# Altium schematic sheet DDR3 Memory.SchDoc
size A4; DrawnBy: Chris Segiet
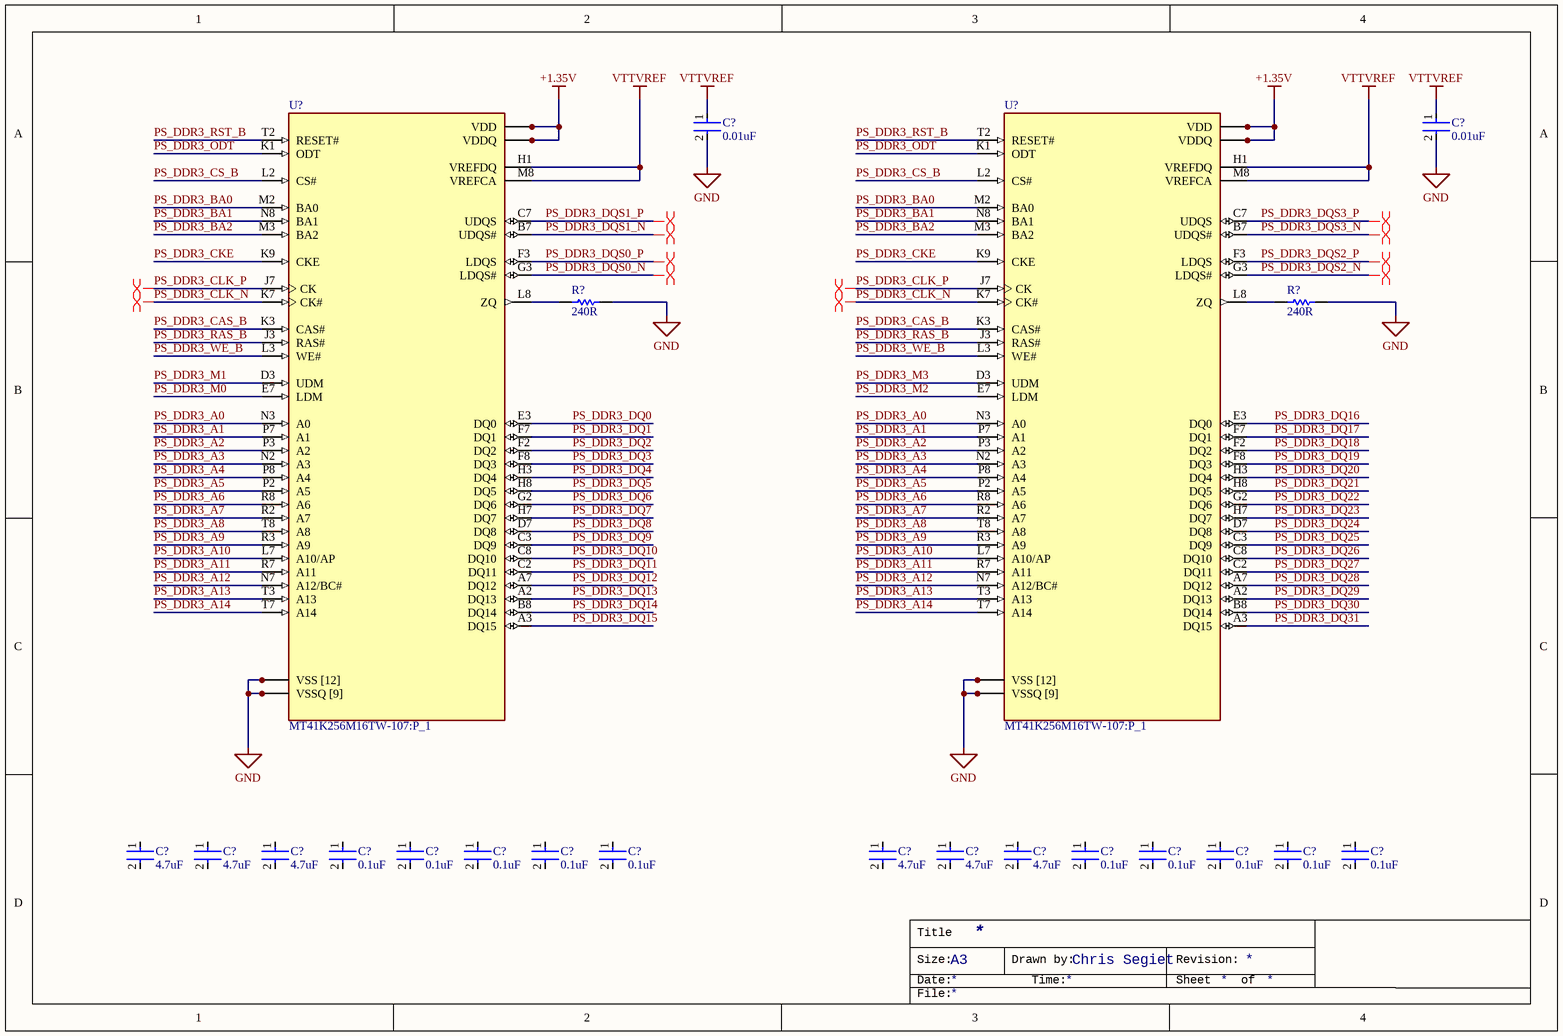
[diagram p0: DDR3 Memory.SchDoc]

## Parts
(Parts that share a designator on the sheet are numbered #1, #2 ... from top to bottom, then left to right.)
C?#1  0.01uF  [FP-C1005-050-0_05-IPC_B]
C?#2  0.01uF  [FP-C1005-050-0_05-IPC_B]
C?#3  4.7uF  [FP-C2012-125-0_2-MFG]
C?#4  4.7uF  [FP-C2012-125-0_2-MFG]
C?#5  4.7uF  [FP-C2012-125-0_2-MFG]
C?#6  0.1uF  [FP-CGA3E-0_3-0_1-IPC_C]
C?#7  0.1uF  [FP-CGA3E-0_3-0_1-IPC_C]
C?#8  0.1uF  [FP-CGA3E-0_3-0_1-IPC_C]
C?#9  0.1uF  [FP-CGA3E-0_3-0_1-IPC_C]
C?#10  0.1uF  [FP-CGA3E-0_3-0_1-IPC_C]
C?#11  4.7uF  [FP-C2012-125-0_2-MFG]
C?#12  4.7uF  [FP-C2012-125-0_2-MFG]
C?#13  4.7uF  [FP-C2012-125-0_2-MFG]
C?#14  0.1uF  [FP-CGA3E-0_3-0_1-IPC_C]
C?#15  0.1uF  [FP-CGA3E-0_3-0_1-IPC_C]
C?#16  0.1uF  [FP-CGA3E-0_3-0_1-IPC_C]
C?#17  0.1uF  [FP-CGA3E-0_3-0_1-IPC_C]
C?#18  0.1uF  [FP-CGA3E-0_3-0_1-IPC_C]
R?#1  240R  [RESC1005X40X25ML05T05]
R?#2  240R  [RESC1005X40X25ML05T05]
U?#1  MT41K256M16TW-107:P_1  [BGA96C80P9X16_1400X800X120]
U?#2  MT41K256M16TW-107:P_1  [BGA96C80P9X16_1400X800X120]

## Nets
+1.35V: U?#1.A1(VDDQ) U?#1.A8(VDDQ) U?#1.B2(VDD) U?#1.C1(VDDQ) U?#1.C9(VDDQ) U?#1.D2(VDDQ) U?#1.D9(VDD) U?#1.E9(VDDQ) U?#1.F1(VDDQ) U?#1.G7(VDD) U?#1.H2(VDDQ) U?#1.H9(VDDQ) U?#1.K2(VDD) U?#1.K8(VDD) U?#1.N1(VDD) U?#1.N9(VDD) U?#1.R1(VDD) U?#1.R9(VDD) U?#2.A1(VDDQ) U?#2.A8(VDDQ) U?#2.B2(VDD) U?#2.C1(VDDQ) U?#2.C9(VDDQ) U?#2.D2(VDDQ) U?#2.D9(VDD) U?#2.E9(VDDQ) U?#2.F1(VDDQ) U?#2.G7(VDD) U?#2.H2(VDDQ) U?#2.H9(VDDQ) U?#2.K2(VDD) U?#2.K8(VDD) U?#2.N1(VDD) U?#2.N9(VDD) U?#2.R1(VDD) U?#2.R9(VDD)
GND: C?#1.2 C?#2.2 R?#1.2 R?#2.2 U?#1.A9(VSS_[12]) U?#1.B1(VSSQ) U?#1.B3(VSS) U?#1.B9(VSSQ) U?#1.D1(VSSQ) U?#1.D8(VSSQ) U?#1.E1(VSS) U?#1.E2(VSSQ) U?#1.E8(VSSQ) U?#1.F9(VSSQ) U?#1.G1(VSSQ) U?#1.G8(VSS) U?#1.G9(VSSQ_[9]) U?#1.J2(VSS) U?#1.J8(VSS) U?#1.M1(VSS) U?#1.M9(VSS) U?#1.P1(VSS) U?#1.P9(VSS) U?#1.T1(VSS) U?#1.T9(VSS) U?#2.A9(VSS_[12]) U?#2.B1(VSSQ) U?#2.B3(VSS) U?#2.B9(VSSQ) U?#2.D1(VSSQ) U?#2.D8(VSSQ) U?#2.E1(VSS) U?#2.E2(VSSQ) U?#2.E8(VSSQ) U?#2.F9(VSSQ) U?#2.G1(VSSQ) U?#2.G8(VSS) U?#2.G9(VSSQ_[9]) U?#2.J2(VSS) U?#2.J8(VSS) U?#2.M1(VSS) U?#2.M9(VSS) U?#2.P1(VSS) U?#2.P9(VSS) U?#2.T1(VSS) U?#2.T9(VSS)
VTTVREF: C?#1.1 C?#2.1 U?#1.H1(VREFDQ) U?#1.M8(VREFCA) U?#2.H1(VREFDQ) U?#2.M8(VREFCA)
PS_DDR3_A0: U?#1.N3(A0) U?#2.N3(A0)
PS_DDR3_A1: U?#1.P7(A1) U?#2.P7(A1)
PS_DDR3_A2: U?#1.P3(A2) U?#2.P3(A2)
PS_DDR3_A3: U?#1.N2(A3) U?#2.N2(A3)
PS_DDR3_A4: U?#1.P8(A4) U?#2.P8(A4)
PS_DDR3_A5: U?#1.P2(A5) U?#2.P2(A5)
PS_DDR3_A6: U?#1.R8(A6) U?#2.R8(A6)
PS_DDR3_A7: U?#1.R2(A7) U?#2.R2(A7)
PS_DDR3_A8: U?#1.T8(A8) U?#2.T8(A8)
PS_DDR3_A9: U?#1.R3(A9) U?#2.R3(A9)
PS_DDR3_A10: U?#1.L7(A10/AP) U?#2.L7(A10/AP)
PS_DDR3_A11: U?#1.R7(A11) U?#2.R7(A11)
PS_DDR3_A12: U?#1.N7(A12/BC#) U?#2.N7(A12/BC#)
PS_DDR3_A13: U?#1.T3(A13) U?#2.T3(A13)
PS_DDR3_A14: U?#1.T7(A14) U?#2.T7(A14)
PS_DDR3_BA0: U?#1.M2(BA0) U?#2.M2(BA0)
PS_DDR3_BA1: U?#1.N8(BA1) U?#2.N8(BA1)
PS_DDR3_BA2: U?#1.M3(BA2) U?#2.M3(BA2)
PS_DDR3_CAS_B: U?#1.K3(CAS#) U?#2.K3(CAS#)
PS_DDR3_CKE: U?#1.K9(CKE) U?#2.K9(CKE)
PS_DDR3_CLK_N: U?#1.K7(CK#) U?#2.K7(CK#)
PS_DDR3_CLK_P: U?#1.J7(CK) U?#2.J7(CK)
PS_DDR3_CS_B: U?#1.L2(CS#) U?#2.L2(CS#)
PS_DDR3_DQ0: U?#1.E3(DQ0)
PS_DDR3_DQ1: U?#1.F7(DQ1)
PS_DDR3_DQ2: U?#1.F2(DQ2)
PS_DDR3_DQ3: U?#1.F8(DQ3)
PS_DDR3_DQ4: U?#1.H3(DQ4)
PS_DDR3_DQ5: U?#1.H8(DQ5)
PS_DDR3_DQ6: U?#1.G2(DQ6)
PS_DDR3_DQ7: U?#1.H7(DQ7)
PS_DDR3_DQ8: U?#1.D7(DQ8)
PS_DDR3_DQ9: U?#1.C3(DQ9)
PS_DDR3_DQ10: U?#1.C8(DQ10)
PS_DDR3_DQ11: U?#1.C2(DQ11)
PS_DDR3_DQ12: U?#1.A7(DQ12)
PS_DDR3_DQ13: U?#1.A2(DQ13)
PS_DDR3_DQ14: U?#1.B8(DQ14)
PS_DDR3_DQ15: U?#1.A3(DQ15)
PS_DDR3_DQ16: U?#2.E3(DQ0)
PS_DDR3_DQ17: U?#2.F7(DQ1)
PS_DDR3_DQ18: U?#2.F2(DQ2)
PS_DDR3_DQ19: U?#2.F8(DQ3)
PS_DDR3_DQ20: U?#2.H3(DQ4)
PS_DDR3_DQ21: U?#2.H8(DQ5)
PS_DDR3_DQ22: U?#2.G2(DQ6)
PS_DDR3_DQ23: U?#2.H7(DQ7)
PS_DDR3_DQ24: U?#2.D7(DQ8)
PS_DDR3_DQ25: U?#2.C3(DQ9)
PS_DDR3_DQ26: U?#2.C8(DQ10)
PS_DDR3_DQ27: U?#2.C2(DQ11)
PS_DDR3_DQ28: U?#2.A7(DQ12)
PS_DDR3_DQ29: U?#2.A2(DQ13)
PS_DDR3_DQ30: U?#2.B8(DQ14)
PS_DDR3_DQ31: U?#2.A3(DQ15)
PS_DDR3_DQS0_N: U?#1.G3(LDQS#)
PS_DDR3_DQS0_P: U?#1.F3(LDQS)
PS_DDR3_DQS1_N: U?#1.B7(UDQS#)
PS_DDR3_DQS1_P: U?#1.C7(UDQS)
PS_DDR3_DQS2_N: U?#2.G3(LDQS#)
PS_DDR3_DQS2_P: U?#2.F3(LDQS)
PS_DDR3_DQS3_N: U?#2.B7(UDQS#)
PS_DDR3_DQS3_P: U?#2.C7(UDQS)
PS_DDR3_M0: U?#1.E7(LDM)
PS_DDR3_M1: U?#1.D3(UDM)
PS_DDR3_M2: U?#2.E7(LDM)
PS_DDR3_M3: U?#2.D3(UDM)
PS_DDR3_ODT: U?#1.K1(ODT) U?#2.K1(ODT)
PS_DDR3_RAS_B: U?#1.J3(RAS#) U?#2.J3(RAS#)
PS_DDR3_RST_B: U?#1.T2(RESET#) U?#2.T2(RESET#)
PS_DDR3_WE_B: U?#1.L3(WE#) U?#2.L3(WE#)
NetR?#1_1: R?#1.1 U?#1.L8(ZQ)
NetR?#2_1: R?#2.1 U?#2.L8(ZQ)

Not connected (* = marked no-connect by the designer): C?#3 1 2; C?#4 1 2; C?#5 1 2; C?#6 1 2; C?#7 1 2; C?#8 1 2; C?#9 1 2; C?#10 1 2; C?#11 1 2; C?#12 1 2; C?#13 1 2; C?#14 1 2; C?#15 1 2; C?#16 1 2; C?#17 1 2; C?#18 1 2

## Layout directives
differential pair: PS_DDR3_CLK_N, PS_DDR3_CLK_P, PS_DDR3_DQS0_N, PS_DDR3_DQS0_P, PS_DDR3_DQS1_N, PS_DDR3_DQS1_P, PS_DDR3_DQS2_N, PS_DDR3_DQS2_P, PS_DDR3_DQS3_N, PS_DDR3_DQS3_P

## Notes on the sheet
- Title
- Size:
- Date:
- A3
- Drawn by:
- Time:
- Revision:
- Sheet
- of
- File:

## Library data of the parts
C?#1 C?#2 = CMP-08246-000726-2: Multilayer Ceramic Capacitors 10nF ±10% 25V X8R SMD 0402; Dissipation Factor: 3%; Length: 1mm; Capacitance: 10nF; Termination: SMD/SMT; Packaging: Tape and Reel; Weight: 2.3E-05oz; Resistor Type: Ceramic; Case/Package: 0402; Number of Pins: 2; Voltage Rating (DC): 25V; Voltage: 25V; Width: 0.02inch; Tolerance: 10%; Depth: 0.5mm; Case Code (Metric): 1005; Dielectric: X8R; RoHS Compliant: Yes; Max Operating Temperature: 150°C; Features: High Temperature; Voltage Rating: 25V; REACH SVHC: No SVHC; Series: C; Package Quantity: 10000; Mount: Surface Mount; Dielectric Material: Ceramic; Case Code (Imperial): 0402; Lead Free: Lead Free; Thickness: 0.022inch; Height: 0.5mm; Min Operating Temperature: -55°C
C?#3-C?#5 C?#11-C?#13 = CMP-08246-004908-1: Multilayer Ceramic Capacitors 4.7μF ±10% 25V X5R SMD 0805; Lead Free: Lead Free; Thickness: 0.057inch; Packaging: Tape and Reel; Min Operating Temperature: -55°C; RoHS Compliant: Yes; Dielectric: X5R; Weight: 0.000194oz; REACH SVHC: No SVHC; Voltage Rating (DC): 25V; Mount: Surface Mount; Capacitance: 4.7uF; Resistor Type: Ceramic; Termination: SMD/SMT; Number of Pins: 2; Case Code (Imperial): 0805; Dielectric Material: Ceramic; Voltage: 25V; Voltage Rating: 25V; Case Code (Metric): 2012; Case/Package: 0805; Max Operating Temperature: 85°C; Height: 1.25mm; Tolerance: 10%; Depth: 1.25mm; Package Quantity: 1; Length: 2mm; Radiation Hardening: No; Width: 1.25mm
C?#6-C?#10 C?#14-C?#18 = CMP-08246-002186-1: Cap Ceramic 100nF 25V X7R 10% Pad SMD 0603 +125°C Automotive T/R; Composition: Ceramic; Dielectric: X7R; Ratings: AEC-Q200; Length: 1.6mm; REACH SVHC: No SVHC; Width: 0.031inch; Packaging: Tape and Reel; Case/Package: 0603; Height: 0.8mm; Termination: SMD/SMT; Max Operating Temperature: 125°C; Thickness: 0.035inch; Case Code (Metric): 1608; Lead Free: Lead Free; Mount: Surface Mount; Voltage Rating (DC): 25V; Capacitance: 100nF; Voltage Rating: 25V; Tolerance: 10%; Weight: 7.1E-05oz; Min Operating Temperature: -55°C; Package Quantity: 1; Depth: 0.8mm; Case Code (Imperial): 0603
R?#1 R?#2 = CMP-2002-00493-3: Chip Resistor, 240 Ohm, +/- 5%, 100 mW, -55 to 155 degC, 0402 (1005 Metric), RoHS, Tape and Reel; PartNumber: ERJ-2GEJ241x; Manufacturer: Basic Passives; Resistance: 240 Ohm; Voltage Rating: 50 V; Case\/Package: 0402; Power Rating: 100 mW; PackageReference: 0402; ComponentLink1URL: http://www.panasonic.com/; ComponentLink2Description: Datasheet; PackageDescription: 2-Pin Surface Mount Device, Body 1 x 0.5 mm; Tolerance: 5%; Radiation Hardening: No; Packaging: Tape and Reel; Case Code (Metric): 1005; Case Code (Imperial): 0402; Mount: Surface Mount; REACH SVHC: Yes; Length: 1 mm; Mounting Technology: Surface Mount; Max Operating Temperature: 155 degC; Height: 0.35 mm; Width: 0.5 mm; Package Quantity: 10000; RoHSCompliant: true; DatasheetVersion: 03/2015; Pins: 2; ComponentLink1Description: Manufacturer URL; Min Operating Temperature: -55 degC; ComponentLink2URL: http://industrial.panasonic.com/cdbs/www-data/pdf/RDA0000/AOA0000C84.pdf
U?#1 U?#2 = MT41K256M16TW-107:P_1: SDRAM - DDR3L Memory IC 4Gb (256M x 16) Parallel 933MHz 20ns 96-FBGA (8x14); MF: {'manufacturer': u'Micron Technology Inc.'}; Price: None; Value: *; Package: None; Availability: Unavailable; MP: MT41K256M16TW-107:P